# Altium schematic sheet MotorBoard.SchDoc
size B
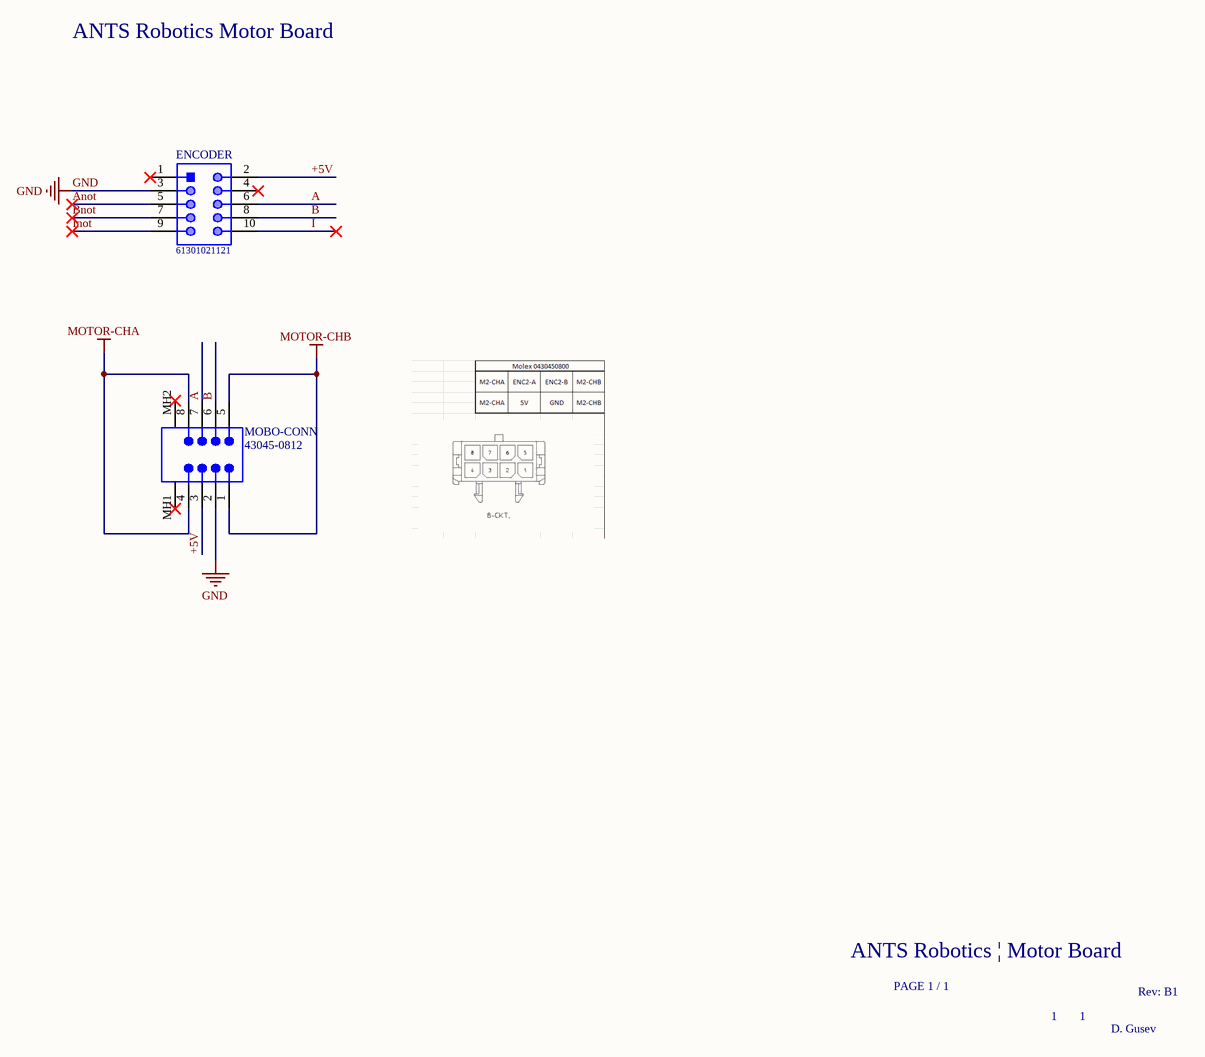
[diagram p0: MotorBoard.SchDoc]

## Parts
ENCODER  61301021121  [61301021121]
MOBO-CONN  43045-0812  [MOLX-43045-0812_V]

## Nets
GND: ENCODER.3 MOBO-CONN.2
MOTOR-CHA: MOBO-CONN.4 MOBO-CONN.8
MOTOR-CHB: MOBO-CONN.1 MOBO-CONN.5
+5V: ENCODER.2 MOBO-CONN.3
A: ENCODER.6 MOBO-CONN.7
Anot: ENCODER.5
B: ENCODER.8 MOBO-CONN.6
Bnot: ENCODER.7
I: ENCODER.10
Inot: ENCODER.9

Not connected (* = marked no-connect by the designer): ENCODER 1* 4*; MOBO-CONN MH1* MH2*

## Notes on the sheet
- ANTS Robotics Motor Board
- ANTS Robotics | Motor Board
- PAGE 1 / 1
- 1
- Rev: B1
- D. Gusev

## Library data of the parts
ENCODER = CMP-1502-01084-1: THT Vertical Pin Header WR-PHD, Pitch 2.54 mm, Dual Row, 10 pins; Manufacturer: Wurth Elektronik; Working Voltage: 250VAC; Pitch: 2.54mm; Contact Resistance: 20mOhm; Gender: Male; Rated Current: 3A; Withstanding Voltage: 500VAC; Pin Number: 10; Operating Temperature: -40to105degC; Mounting Technology: THT; Publisher: WurthElektronik; Manufacturer URL: http://www.we-online.de; Part Number: 61301021121; Row Number: Dual; Packaging: Bag; Orientation: Vertical; Package Reference: 61301021121; Datasheet URL: https://katalog.we-online.de/em/datasheet/6130xx21121.pdf
MOBO-CONN = CMP-1594-00003-1: 3 mm Pitch Micro-Fit 3.0 Connector, 17.27 mm Mated Height, Vertical, Through Hole, 8 Circuits, -40 to 105 degC, RoHS, Tray; Pitch: 3 mm; No. of Positions: 8; No. of Rows: 2; ComponentLink2Description: Datasheet; ComponentLink2URL: http://www.molex.com/webdocs/datasheets/pdf/en-us/0430450812_PCB_HEADERS.pdf; Orientation: Vertical; PartNumber: 43045-0812; Packing: Tray; Temperature Min: -40 degC; RoHS: TRUE; ComponentLink3Description: Package Specification; Temperature Max: 105 degC; ComponentLink3URL: http://www.molex.com/pdm_docs/sd/430450812_sd.pdf; Mounting Technology: Through Hole; PackageVersion: Rev. F, 06/2009; ComponentLink1Description: Manufacturer URL; PackageDescription: 8-Pin PCB Header, Vertical, Pitch 3 mm, Mated Height 17.27 mm, Through Hole; ComponentLink1URL: http://www.molex.com/